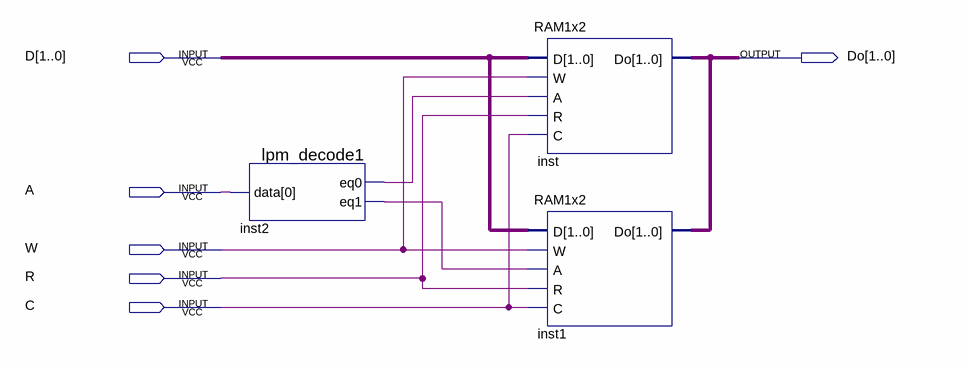
[diagram p0: schematic sheet]
// Quartus schematic RAM2x2.bdf as structural Verilog: 3 symbols, 6 pins
module RAM2x2 (
  input  [1:0] D,
  input  A,
  input  W,
  input  R,
  input  C,
  output [1:0] Do
);

  wire inst2_eq0, inst2_eq1;

  lpm_decode1 inst2 (.data(A), .eq0(inst2_eq0), .eq1(inst2_eq1));
  RAM1x2 inst (.D(D), .W(W), .A(inst2_eq0), .R(R), .C(C), .Do(Do));
  RAM1x2 inst1 (.D(D), .W(W), .A(inst2_eq1), .R(R), .C(C), .Do(Do));
endmodule
